# EAGLE schematic main (EAGLE 5.11)

## Sheet 1 of 9
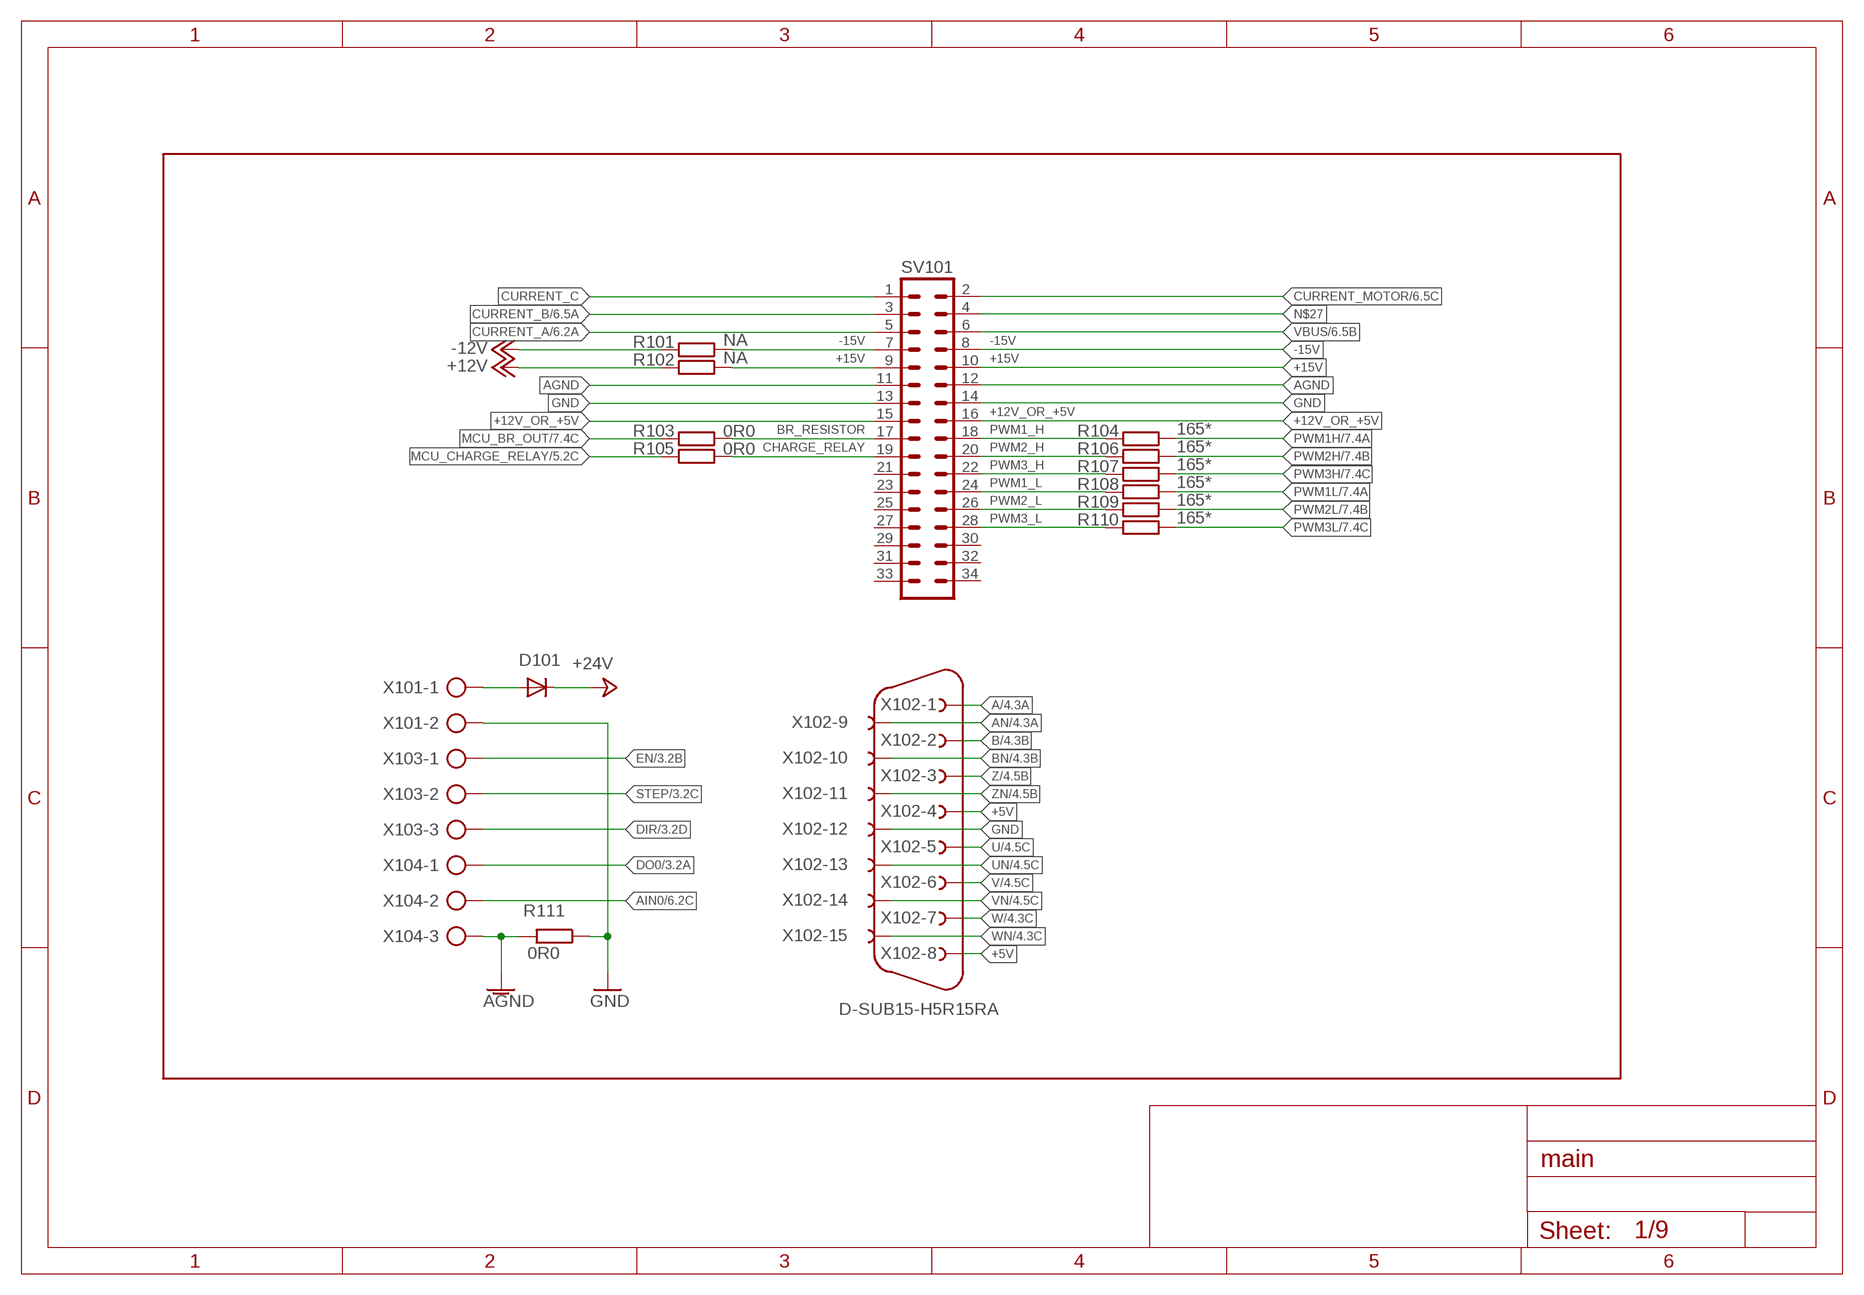
[diagram p0: schematic, sheet 1]

### Parts
D101  DIODE-SMB  [SMB]
R101  NA  R-EU_0204/2V  [0204V]
R102  NA  R-EU_0204/2V  [0204V]
R103  0R0  R-EU_0204/7  [0204/7]
R104  165*  R-EU_0204/2V  [0204V]
R105  0R0  R-EU_0204/7  [0204/7]
R106  165*  R-EU_0204/2V  [0204V]
R107  165*  R-EU_0204/2V  [0204V]
R108  165*  R-EU_0204/2V  [0204V]
R109  165*  R-EU_0204/2V  [0204V]
R110  165*  R-EU_0204/2V  [0204V]
R111  0R0  R-EU_0204/7  [0204/7]
SV101  ML34  [ML34]
X101  TS-502-2P  [TS-502-2P]
X102  D-SUB15-H5R15RA  [H5R15RA]
X103  TS-502-3P  [TS-502-3P]
X104  TS-502-3P  [TS-502-3P]

### Nets
+5V: X102.4 X102.8 ; also sheet 2,4
+12V: R102.2
+12V_OR_+5V: SV101.15 SV101.16
+15V: R102.1 SV101.9 SV101.10
+24V: D101.C ; also sheet 2,3
-12V: R101.2
-15V: R101.1 SV101.7 SV101.8
A: X102.1 ; also sheet 4
AGND: R111.2 SV101.11 SV101.12 X104.P$3 ; also sheet 6
AIN0: X104.P$2 ; also sheet 6
AN: X102.9 ; also sheet 4
B: X102.2 ; also sheet 4
BN: X102.10 ; also sheet 4
BR_RESISTOR: R103.1 SV101.17
CHARGE_RELAY: R105.1 SV101.19
CURRENT_A: SV101.5 ; also sheet 6
CURRENT_B: SV101.3 ; also sheet 6
CURRENT_C: SV101.1
CURRENT_MOTOR: SV101.2 ; also sheet 6
DIR: X103.P$3 ; also sheet 3
DO0: X104.P$1 ; also sheet 3
EN: X103.P$1 ; also sheet 3
GND: R111.1 SV101.13 SV101.14 X101.P$2 X102.12 ; also sheet 2,3,4,5,7,8,9
MCU_BR_OUT: R103.2 ; also sheet 7
MCU_CHARGE_RELAY: R105.2 ; also sheet 5
N$10: D101.A X101.P$1
N$27: SV101.4
PWM1_H: R104.2 SV101.18
PWM1_L: R108.2 SV101.24
PWM1H: R104.1 ; also sheet 7
PWM1L: R108.1 ; also sheet 7
PWM2_H: R106.2 SV101.20
PWM2_L: R109.2 SV101.26
PWM2H: R106.1 ; also sheet 7
PWM2L: R109.1 ; also sheet 7
PWM3_H: R107.2 SV101.22
PWM3_L: R110.2 SV101.28
PWM3H: R107.1 ; also sheet 7
PWM3L: R110.1 ; also sheet 7
STEP: X103.P$2 ; also sheet 3
U: X102.5 ; also sheet 4
UN: X102.13 ; also sheet 4
V: X102.6 ; also sheet 4
VBUS: SV101.6 ; also sheet 6
VN: X102.14 ; also sheet 4
W: X102.7 ; also sheet 4
WN: X102.15 ; also sheet 4
Z: X102.3 ; also sheet 4
ZN: X102.11 ; also sheet 4
Unconnected: SV101.21 SV101.23 SV101.25 SV101.27 SV101.29 SV101.30 SV101.31 SV101.32 SV101.33 SV101.34

## Sheet 2 of 9
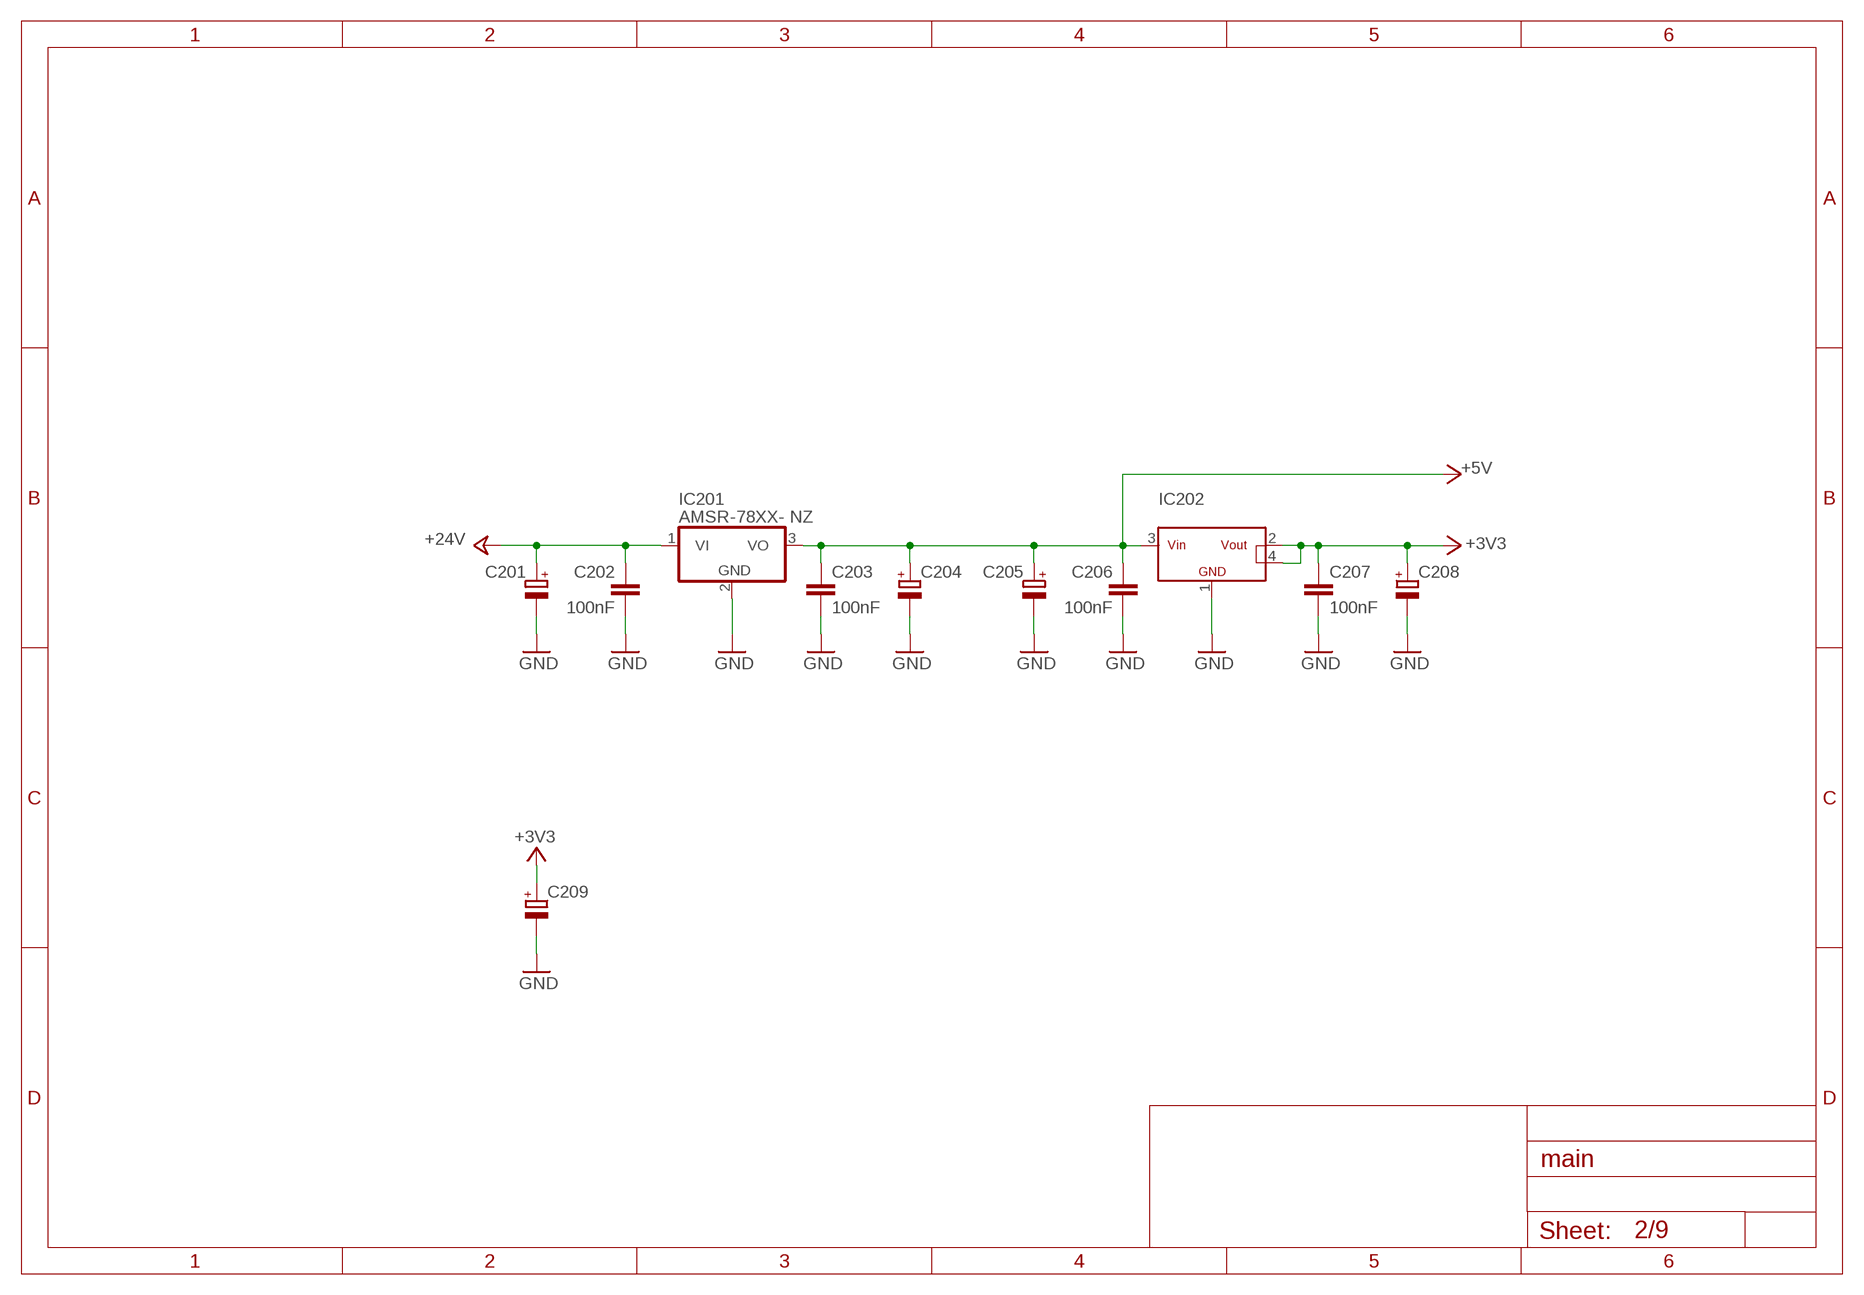
[diagram p1: schematic, sheet 2]

### Parts
C201  CPOL-EUE2.5-6  [E2,5-6]
C202  100nF  C-EUC1206  [C1206]
C203  100nF  C-EUC1206  [C1206]
C204  CPOL-EUE2.5-6  [E2,5-6]
C205  CPOL-EUE2.5-6  [E2,5-6]
C206  100nF  C-EUC1206  [C1206]
C207  100nF  C-EUC1206  [C1206]
C208  CPOL-EUE2.5-6  [E2,5-6]
C209  CPOL-EUE2.5-6  [E2,5-6]
IC201  AMSR-78XX- NZ  7805TV  [TO220V]
IC202  LM317_SOT223  [SOT223]

### Nets
+3V3: C207.1 C208.+ C209.+ IC202.2 IC202.4(TAB) ; also sheet 3,5,6,7,8,9
+5V: C203.1 C204.+ C205.+ C206.1 IC201.3(VO) IC202.3 ; also sheet 1,4
+24V: C201.+ C202.1 IC201.1(VI) ; also sheet 1,3
GND: C201.- C202.2 C203.2 C204.- C205.- C206.2 C207.2 C208.- C209.- IC201.2(GND) IC202.1 ; also sheet 1,3,4,5,7,8,9

## Sheet 3 of 9
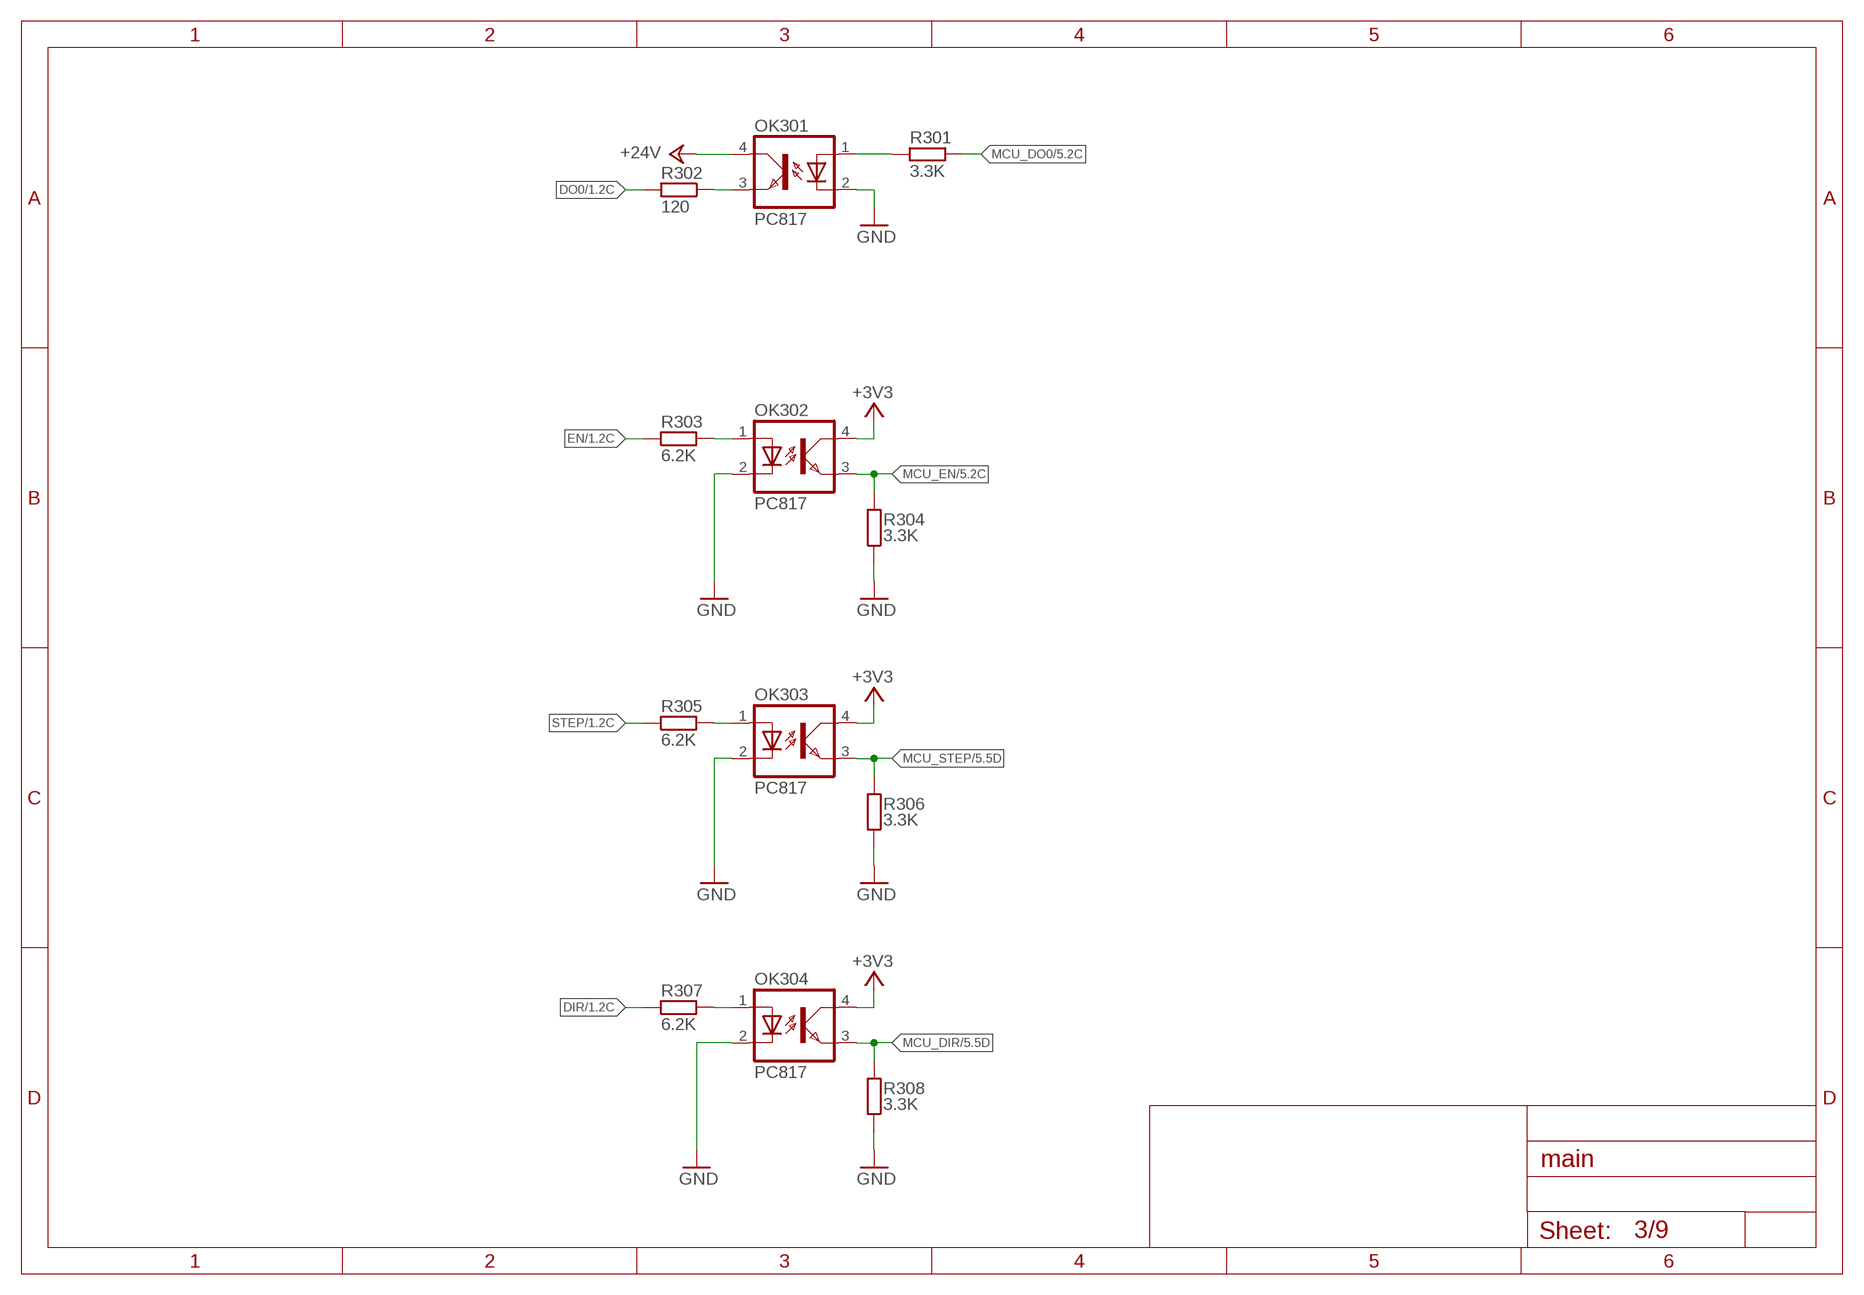
[diagram p2: schematic, sheet 3]

### Parts
OK301  PC817  [DIL04]
OK302  PC817  [DIL04]
OK303  PC817  [DIL04]
OK304  PC817  [DIL04]
R301  3.3K  R-EU_0204/2V  [0204V]
R302  120  R-EU_0204/2V  [0204V]
R303  6.2K  R-EU_0204/2V  [0204V]
R304  3.3K  R-EU_0204/2V  [0204V]
R305  6.2K  R-EU_0204/2V  [0204V]
R306  3.3K  R-EU_0204/2V  [0204V]
R307  6.2K  R-EU_0204/2V  [0204V]
R308  3.3K  R-EU_0204/2V  [0204V]

### Nets
+3V3: OK302.4(COL) OK303.4(COL) OK304.4(COL) ; also sheet 2,5,6,7,8,9
+24V: OK301.4(COL) ; also sheet 1,2
DIR: R307.1 ; also sheet 1
DO0: R302.2 ; also sheet 1
EN: R303.1 ; also sheet 1
GND: OK301.2(C) OK302.2(C) OK303.2(C) OK304.2(C) R304.1 R306.1 R308.1 ; also sheet 1,2,4,5,7,8,9
MCU_DIR: OK304.3(EMIT) R308.2 ; also sheet 5
MCU_DO0: R301.1 ; also sheet 5
MCU_EN: OK302.3(EMIT) R304.2 ; also sheet 5
MCU_STEP: OK303.3(EMIT) R306.2 ; also sheet 5
N$42: OK301.3(EMIT) R302.1
N$43: OK302.1(A) R303.2
N$44: OK303.1(A) R305.2
N$45: OK304.1(A) R307.2
N$47: OK301.1(A) R301.2
STEP: R305.1 ; also sheet 1

## Sheet 4 of 9
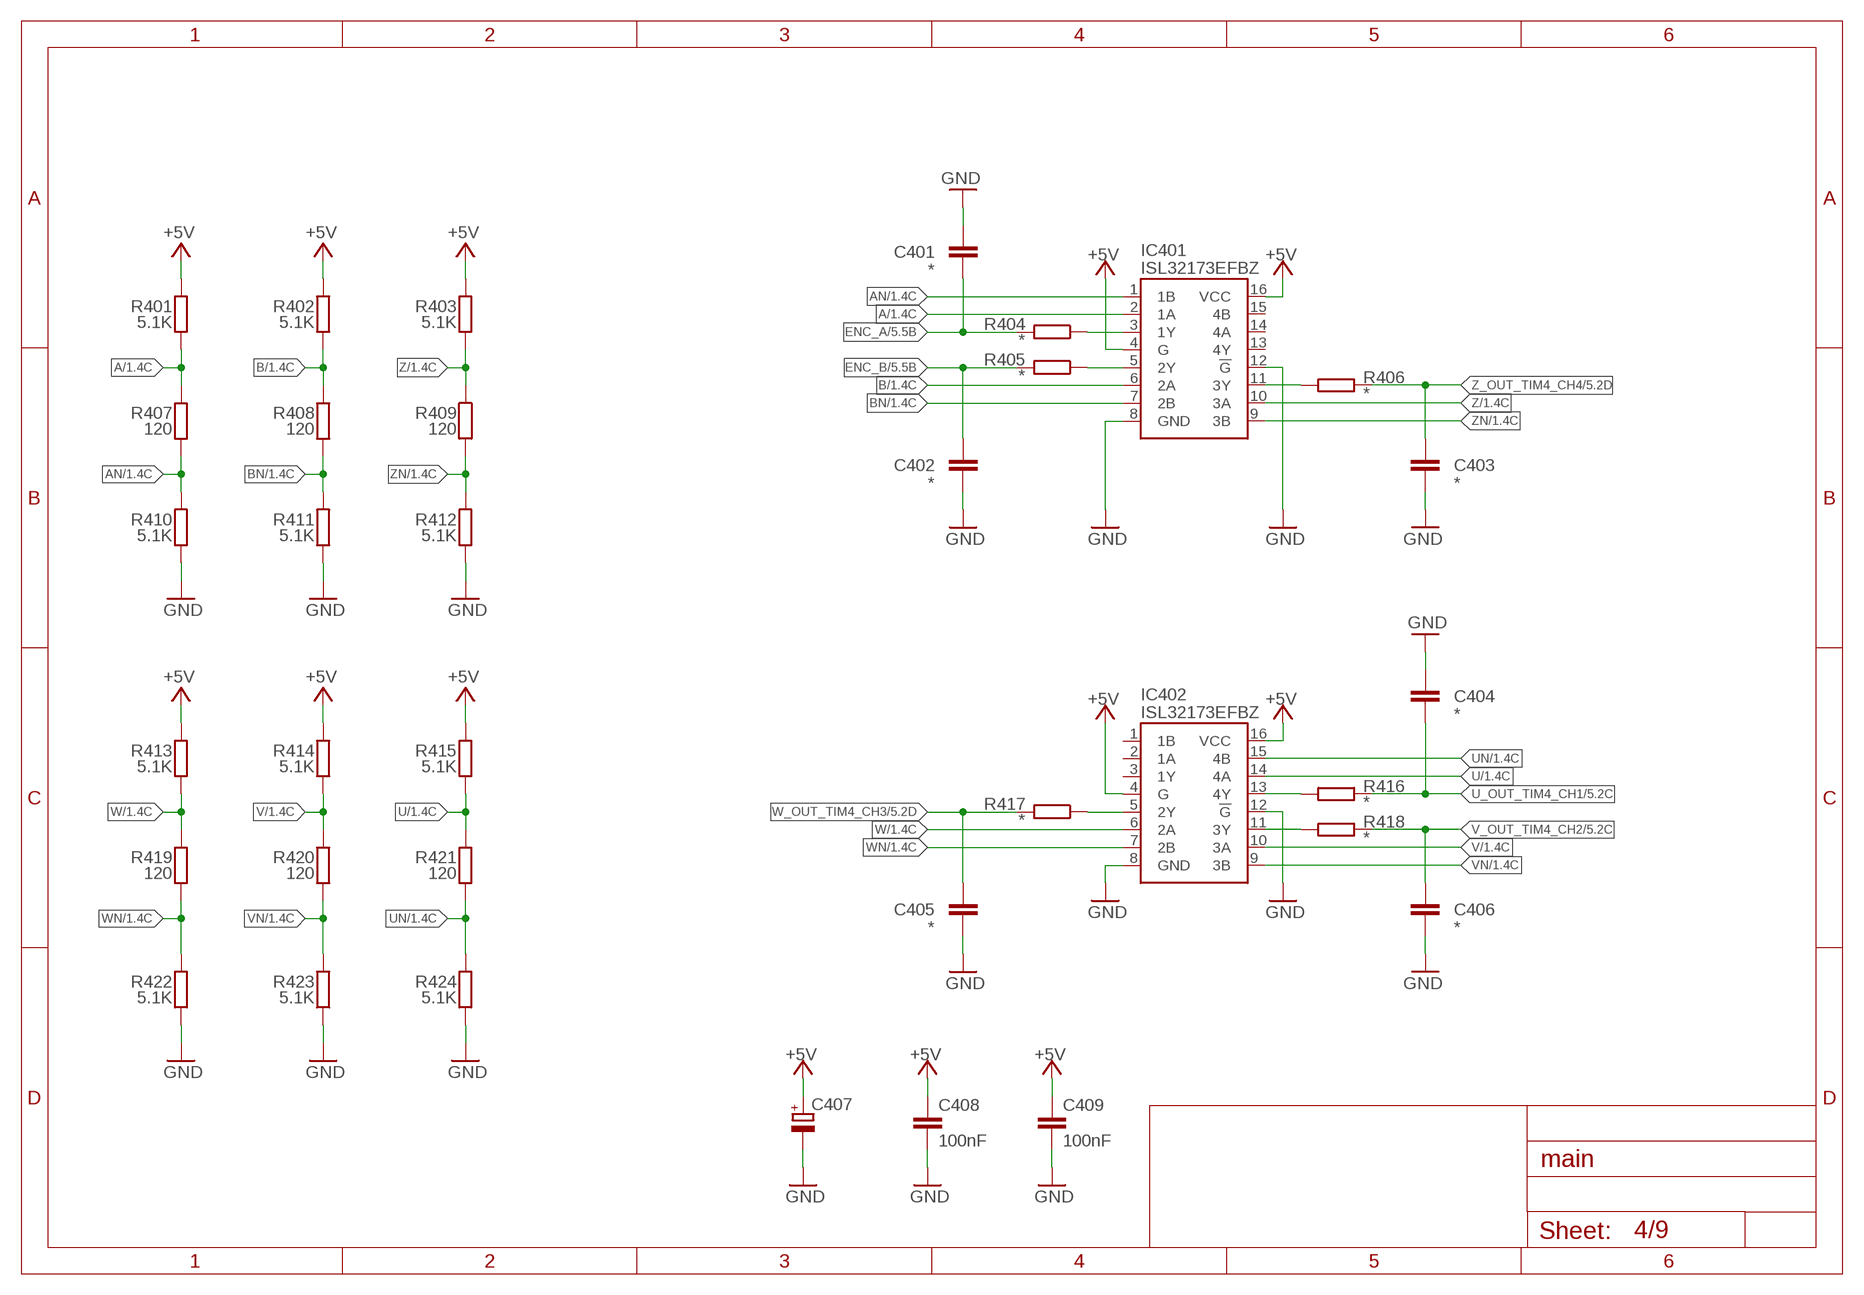
[diagram p3: schematic, sheet 4]

### Parts
C401  *  C-EUC0805  [C0805]
C402  *  C-EUC0805  [C0805]
C403  *  C-EUC0805  [C0805]
C404  *  C-EUC0805  [C0805]
C405  *  C-EUC0805  [C0805]
C406  *  C-EUC0805  [C0805]
C407  CPOL-EUE3.5-8  [E3,5-8]
C408  100nF  C-EUC0805  [C0805]
C409  100nF  C-EUC0805  [C0805]
IC401  ISL32173EFBZ  AM26LS32ACD  [SO16]
IC402  ISL32173EFBZ  AM26LS32ACD  [SO16]
R401  5.1K  R-EU_R0603  [R0603]
R402  5.1K  R-EU_R0603  [R0603]
R403  5.1K  R-EU_R0603  [R0603]
R404  *  R-EU_R1206  [R1206]
R405  *  R-EU_R1206  [R1206]
R406  *  R-EU_R1206  [R1206]
R407  120  R-EU_R1206  [R1206]
R408  120  R-EU_R1206  [R1206]
R409  120  R-EU_R1206  [R1206]
R410  5.1K  R-EU_R0603  [R0603]
R411  5.1K  R-EU_R0603  [R0603]
R412  5.1K  R-EU_R0603  [R0603]
R413  5.1K  R-EU_R0603  [R0603]
R414  5.1K  R-EU_R0603  [R0603]
R415  5.1K  R-EU_R0603  [R0603]
R416  *  R-EU_R1206  [R1206]
R417  *  R-EU_R1206  [R1206]
R418  *  R-EU_R1206  [R1206]
R419  120  R-EU_R1206  [R1206]
R420  120  R-EU_R1206  [R1206]
R421  120  R-EU_R1206  [R1206]
R422  5.1K  R-EU_R0603  [R0603]
R423  5.1K  R-EU_R0603  [R0603]
R424  5.1K  R-EU_R0603  [R0603]

### Nets
+5V: C407.+ C408.1 C409.1 IC401.4(G) IC401.16(VCC) IC402.4(G) IC402.16(VCC) R401.2 R402.2 R403.2 R413.2 R414.2 R415.2 ; also sheet 1,2
A: IC401.2(1A) R401.1 R407.1 ; also sheet 1
AN: IC401.1(1B) R407.2 R410.2 ; also sheet 1
B: IC401.6(2A) R402.1 R408.1 ; also sheet 1
BN: IC401.7(2B) R408.2 R411.2 ; also sheet 1
ENC_A: C401.2 R404.2 ; also sheet 5
ENC_B: C402.1 R405.2 ; also sheet 5
GND: C401.1 C402.2 C403.2 C404.1 C405.2 C406.2 C407.- C408.2 C409.2 IC401.8(GND) IC401.12(!G) IC402.8(GND) IC402.12(!G) R410.1 R411.1 R412.1 R422.1 R423.1 R424.1 ; also sheet 1,2,3,5,7,8,9
N$3: IC401.5(2Y) R405.1
N$60: IC401.3(1Y) R404.1
N$61: IC401.11(3Y) R406.2
N$62: IC402.11(3Y) R418.2
N$63: IC402.13(4Y) R416.2
N$64: IC402.5(2Y) R417.1
U: IC402.14(4A) R415.1 R421.1 ; also sheet 1
U_OUT_TIM4_CH1: C404.2 R416.1 ; also sheet 5
UN: IC402.15(4B) R421.2 R424.2 ; also sheet 1
V: IC402.10(3A) R414.1 R420.1 ; also sheet 1
V_OUT_TIM4_CH2: C406.1 R418.1 ; also sheet 5
VN: IC402.9(3B) R420.2 R423.2 ; also sheet 1
W: IC402.6(2A) R413.1 R419.1 ; also sheet 1
W_OUT_TIM4_CH3: C405.1 R417.2 ; also sheet 5
WN: IC402.7(2B) R419.2 R422.2 ; also sheet 1
Z: IC401.10(3A) R403.1 R409.1 ; also sheet 1
Z_OUT_TIM4_CH4: C403.1 R406.1 ; also sheet 5
ZN: IC401.9(3B) R409.2 R412.2 ; also sheet 1
Unconnected: IC401.13(4Y) IC401.14(4A) IC401.15(4B) IC402.1(1B) IC402.2(1A) IC402.3(1Y)

## Sheet 5 of 9
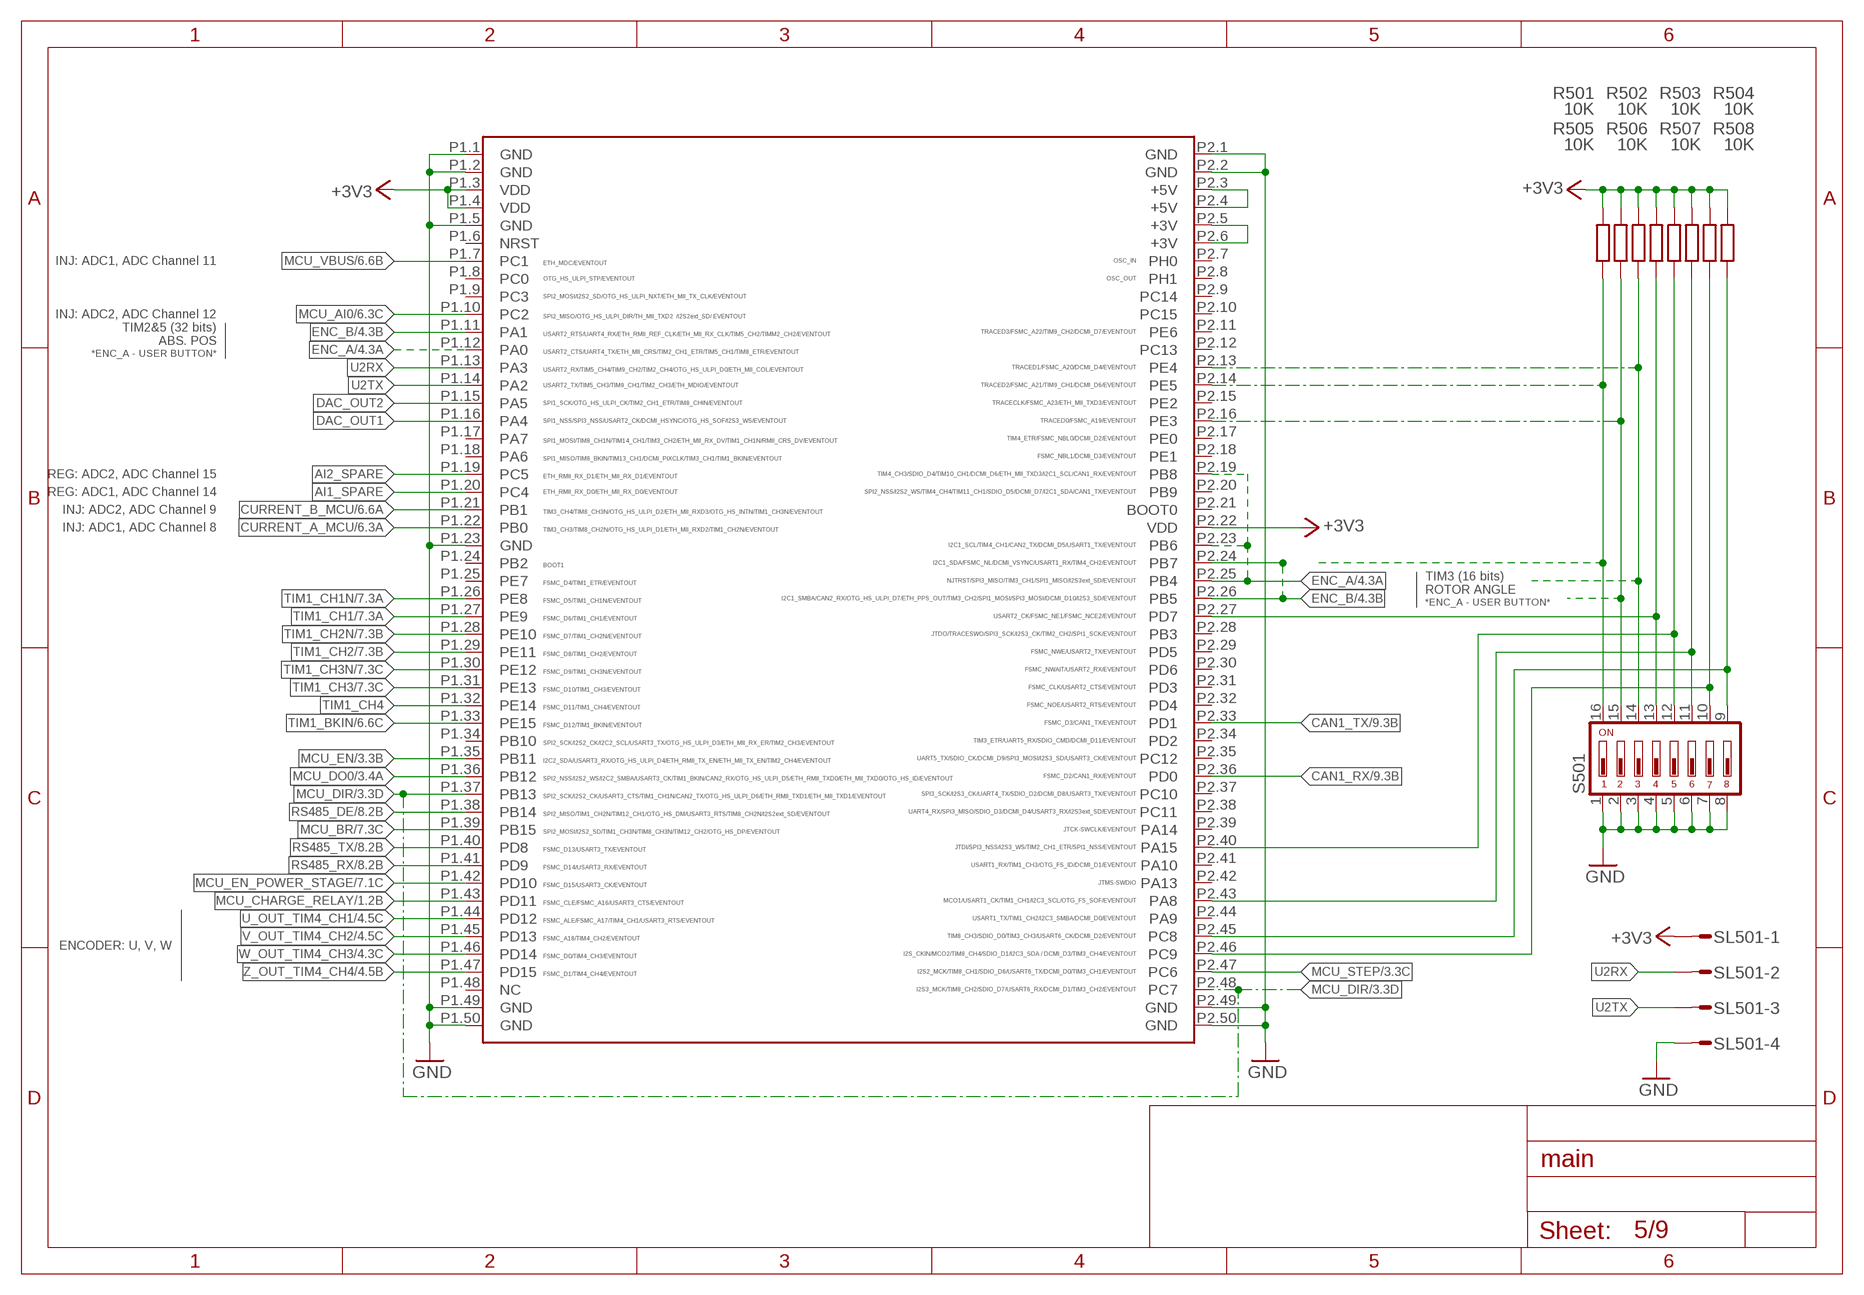
[diagram p4: schematic, sheet 5]

### Parts
IC501  STM32F4-DISCOVERYSTM32F4-DISCOVERY  [STM32F4-DISCOVERY]
R501  10K  R-EU_R0603  [R0603]
R502  10K  R-EU_R0603  [R0603]
R503  10K  R-EU_R0603  [R0603]
R504  10K  R-EU_R0603  [R0603]
R505  10K  R-EU_R0603  [R0603]
R506  10K  R-EU_R0603  [R0603]
R507  10K  R-EU_R0603  [R0603]
R508  10K  R-EU_R0603  [R0603]
S501  DS08  [DS-08]
SL501  M04S  [04P]

### Nets
+3V3: IC501.P1.3(VDD) IC501.P1.4(VDD) IC501.P2.22(VDD) R501.2 R502.2 R503.2 R504.2 R505.2 R506.2 R507.2 R508.2 SL501.1 ; also sheet 2,3,6,7,8,9
AI1_SPARE: IC501.P1.20(PC4)
AI2_SPARE: IC501.P1.19(PC5)
CAN1_RX: IC501.P2.36(PD0) ; also sheet 9
CAN1_TX: IC501.P2.33(PD1) ; also sheet 9
CURRENT_A_MCU: IC501.P1.22(PB0) ; also sheet 6
CURRENT_B_MCU: IC501.P1.21(PB1) ; also sheet 6
DAC_OUT1: IC501.P1.16(PA4)
DAC_OUT2: IC501.P1.15(PA5)
ENC_A: IC501.P1.12(PA0) IC501.P2.19(PB8) IC501.P2.23(PB6) IC501.P2.25(PB4) ; also sheet 4
ENC_B: IC501.P1.11(PA1) IC501.P2.24(PB7) IC501.P2.26(PB5) ; also sheet 4
GND: IC501.P1.1(GND) IC501.P1.2(GND) IC501.P1.5(GND) IC501.P1.23(GND) IC501.P1.49(GND) IC501.P1.50(GND) IC501.P2.1(GND) IC501.P2.2(GND) IC501.P2.49(GND) IC501.P2.50(GND) S501.1 S501.2 S501.3 S501.4 S501.5 S501.6 S501.7 S501.8 SL501.4 ; also sheet 1,2,3,4,7,8,9
MCU_AI0: IC501.P1.10(PC2) ; also sheet 6
MCU_BR: IC501.P1.39(PB15) ; also sheet 7
MCU_CHARGE_RELAY: IC501.P1.43(PD11) ; also sheet 1
MCU_DIR: IC501.P1.37(PB13) IC501.P2.48(PC7) ; also sheet 3
MCU_DO0: IC501.P1.36(PB12) ; also sheet 3
MCU_EN: IC501.P1.35(PB11) ; also sheet 3
MCU_EN_POWER_STAGE: IC501.P1.42(PD10) ; also sheet 7
MCU_STEP: IC501.P2.47(PC6) ; also sheet 3
MCU_VBUS: IC501.P1.7(PC1) ; also sheet 6
N$8: IC501.P2.5(+3V) IC501.P2.6(+3V)
N$9: IC501.P2.3(+5V) IC501.P2.4(+5V)
N$29: IC501.P2.45(PC8) R508.1 S501.9
N$30: IC501.P2.43(PA8) R506.1 S501.11
N$35: IC501.P2.14(PE5) R501.1 S501.16
N$72: IC501.P2.27(PD7) R504.1 S501.13
N$74: IC501.P2.16(PE3) R502.1 S501.15
N$75: IC501.P2.13(PE4) R503.1 S501.14
N$77: IC501.P2.46(PC9) R507.1 S501.10
N$78: IC501.P2.40(PA15) R505.1 S501.12
RS485_DE: IC501.P1.38(PB14) ; also sheet 8
RS485_RX: IC501.P1.41(PD9) ; also sheet 8
RS485_TX: IC501.P1.40(PD8) ; also sheet 8
TIM1_BKIN: IC501.P1.33(PE15) ; also sheet 6
TIM1_CH1: IC501.P1.27(PE9) ; also sheet 7
TIM1_CH1N: IC501.P1.26(PE8) ; also sheet 7
TIM1_CH2: IC501.P1.29(PE11) ; also sheet 7
TIM1_CH2N: IC501.P1.28(PE10) ; also sheet 7
TIM1_CH3: IC501.P1.31(PE13) ; also sheet 7
TIM1_CH3N: IC501.P1.30(PE12) ; also sheet 7
TIM1_CH4: IC501.P1.32(PE14)
U2RX: IC501.P1.13(PA3) SL501.2
U2TX: IC501.P1.14(PA2) SL501.3
U_OUT_TIM4_CH1: IC501.P1.44(PD12) ; also sheet 4
V_OUT_TIM4_CH2: IC501.P1.45(PD13) ; also sheet 4
W_OUT_TIM4_CH3: IC501.P1.46(PD14) ; also sheet 4
Z_OUT_TIM4_CH4: IC501.P1.47(PD15) ; also sheet 4
Unconnected: IC501.P1.6(NRST) IC501.P1.8(PC0) IC501.P1.9(PC3) IC501.P1.17(PA7) IC501.P1.18(PA6) IC501.P1.24(PB2) IC501.P1.25(PE7) IC501.P1.34(PB10) IC501.P1.48(NC) IC501.P2.7(PH0) IC501.P2.8(PH1) IC501.P2.9(PC14) IC501.P2.10(PC15) IC501.P2.11(PE6) IC501.P2.12(PC13) IC501.P2.15(PE2) IC501.P2.17(PE0) IC501.P2.18(PE1) IC501.P2.20(PB9) IC501.P2.21(BOOT0) IC501.P2.28(PB3) IC501.P2.29(PD5) IC501.P2.30(PD6) IC501.P2.31(PD3) IC501.P2.32(PD4) IC501.P2.34(PD2) IC501.P2.35(PC12) IC501.P2.37(PC10) IC501.P2.38(PC11) IC501.P2.39(PA14) IC501.P2.41(PA10) IC501.P2.42(PA13) IC501.P2.44(PA9)

### Notes on the sheet
- INJ: ADC1, ADC Channel 11
- INJ: ADC2, ADC Channel 12
- TIM2&5 (32 bits)
- ABS. POS
- *ENC_A - USER BUTTON*
- REG: ADC2, ADC Channel 15
- REG: ADC1, ADC Channel 14
- INJ: ADC2, ADC Channel 9
- INJ: ADC1, ADC Channel 8
- TIM3 (16 bits)
- ROTOR ANGLE
- *ENC_A - USER BUTTON*
- ENCODER: U, V, W

## Sheet 6 of 9
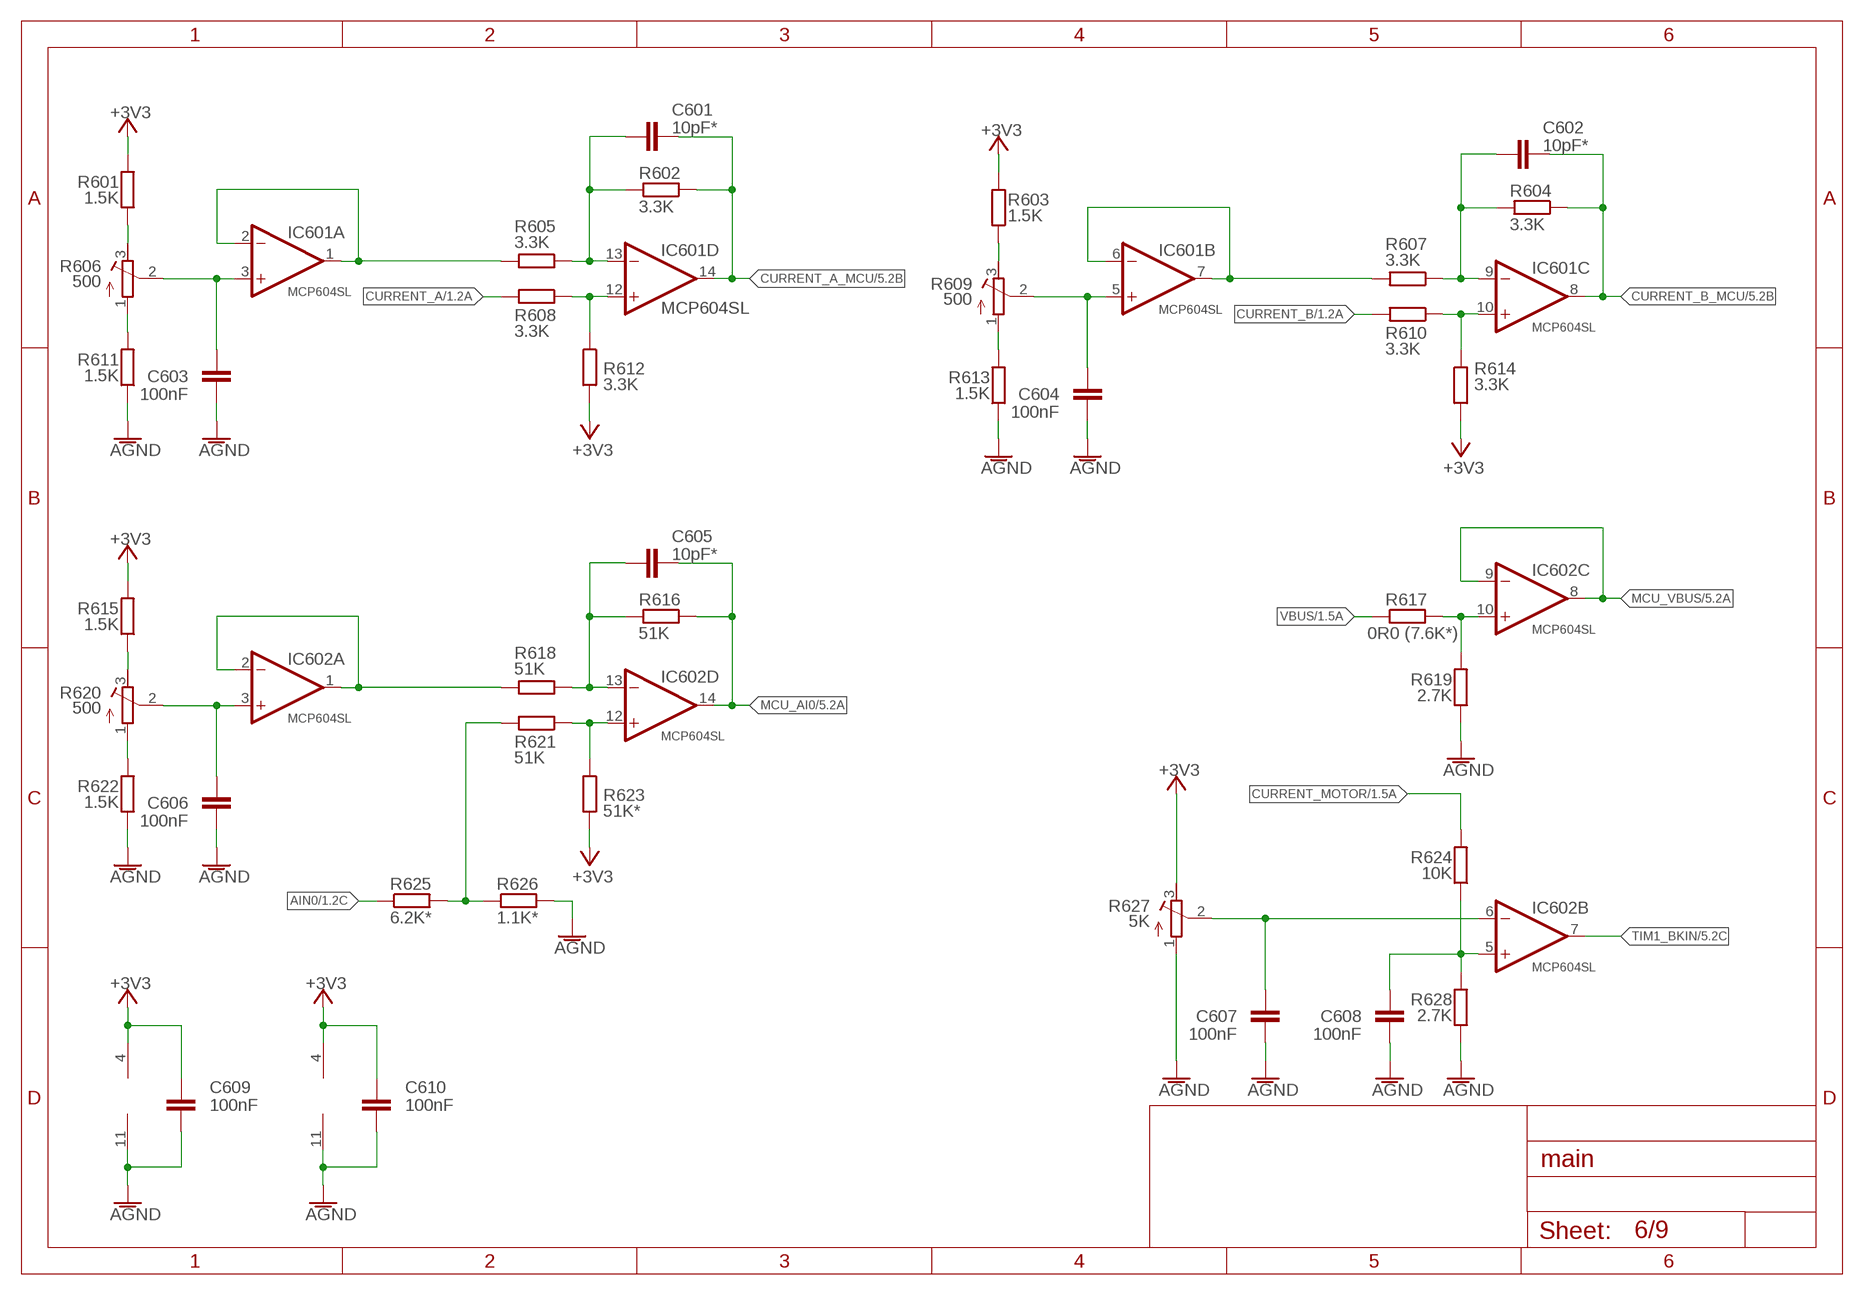
[diagram p5: schematic, sheet 6]

### Parts
C601  10pF*  C-EUC0603  [C0603]
C602  10pF*  C-EUC0603  [C0603]
C603  100nF  C-EUC0805  [C0805]
C604  100nF  C-EUC0805  [C0805]
C605  10pF*  C-EUC0603  [C0603]
C606  100nF  C-EUC0805  [C0805]
C607  100nF  C-EUC0805  [C0805]
C608  100nF  C-EUC0805  [C0805]
C609  100nF  C-EUC1206  [C1206]
C610  100nF  C-EUC1206  [C1206]
IC601  MCP604SL  [SO14]
IC602  MCP604SL  [SO14]
R601  1.5K  R-EU_0204/2V  [0204V]
R602  3.3K  R-EU_0204/2V  [0204V]
R603  1.5K  R-EU_0204/2V  [0204V]
R604  3.3K  R-EU_0204/2V  [0204V]
R605  3.3K  R-EU_0204/2V  [0204V]
R606  500  R-TRIMM3296W  [RTRIM3296W]
R607  3.3K  R-EU_0204/2V  [0204V]
R608  3.3K  R-EU_0204/2V  [0204V]
R609  500  R-TRIMM3296W  [RTRIM3296W]
R610  3.3K  R-EU_0204/2V  [0204V]
R611  1.5K  R-EU_0204/2V  [0204V]
R612  3.3K  R-EU_0204/2V  [0204V]
R613  1.5K  R-EU_0204/2V  [0204V]
R614  3.3K  R-EU_0204/2V  [0204V]
R615  1.5K  R-EU_0204/2V  [0204V]
R616  51K  R-EU_0204/2V  [0204V]
R617  0R0 (7.6K*)  R-EU_0204/2V  [0204V]
R618  51K  R-EU_0204/2V  [0204V]
R619  2.7K  R-EU_0204/2V  [0204V]
R620  500  R-TRIMM3296W  [RTRIM3296W]
R621  51K  R-EU_0204/2V  [0204V]
R622  1.5K  R-EU_0204/2V  [0204V]
R623  51K*  R-EU_0204/2V  [0204V]
R624  10K  R-EU_0204/2V  [0204V]
R625  6.2K*  R-EU_0204/2V  [0204V]
R626  1.1K*  R-EU_0204/2V  [0204V]
R627  5K  R-TRIMM3296W  [RTRIM3296W]
R628  2.7K  R-EU_0204/2V  [0204V]

### Nets
+3V3: C609.1 C610.1 IC601.4(P:V+) IC602.4(P:V+) R601.2 R603.2 R612.2 R614.2 R615.2 R623.2 R627.3(A) ; also sheet 2,3,5,7,8,9
AGND: C603.2 C604.2 C606.2 C607.2 C608.2 C609.2 C610.2 IC601.11(P:V-) IC602.11(P:V-) R611.1 R613.1 R619.1 R622.1 R626.2 R627.1(E) R628.1 ; also sheet 1
AIN0: R625.1 ; also sheet 1
CURRENT_A: R608.2 ; also sheet 1
CURRENT_A_MCU: C601.1 IC601.14(D:OUT) R602.1 ; also sheet 5
CURRENT_B: R610.2 ; also sheet 1
CURRENT_B_MCU: C602.1 IC601.8(C:OUT) R604.1 ; also sheet 5
CURRENT_MOTOR: R624.2 ; also sheet 1
MCU_AI0: C605.1 IC602.14(D:OUT) R616.1 ; also sheet 5
MCU_VBUS: IC602.8(C:OUT) IC602.9(C:-IN) ; also sheet 5
N$12: IC601.10(C:+IN) R610.1 R614.1
N$13: C602.2 IC601.9(C:-IN) R604.2 R607.1
N$16: IC601.6(B:-IN) IC601.7(B:OUT) R607.2
N$17: C604.1 IC601.5(B:+IN) R609.2(S)
N$18: R603.1 R609.3(A)
N$19: R609.1(E) R613.2
N$20: IC601.12(D:+IN) R608.1 R612.1
N$21: C601.2 IC601.13(D:-IN) R602.2 R605.1
N$22: R621.2 R625.2 R626.1
N$23: IC601.1(A:OUT) IC601.2(A:-IN) R605.2
N$24: C603.1 IC601.3(A:+IN) R606.2(S)
N$25: R601.1 R606.3(A)
N$26: R606.1(E) R611.2
N$54: IC602.12(D:+IN) R621.1 R623.1
N$55: C605.2 IC602.13(D:-IN) R616.2 R618.1
N$56: IC602.1(A:OUT) IC602.2(A:-IN) R618.2
N$57: C606.1 IC602.3(A:+IN) R620.2(S)
N$58: R615.1 R620.3(A)
N$59: R620.1(E) R622.2
N$66: IC602.10(C:+IN) R617.2 R619.2
N$67: C608.1 IC602.5(B:+IN) R624.1 R628.2
N$76: C607.1 IC602.6(B:-IN) R627.2(S)
TIM1_BKIN: IC602.7(B:OUT) ; also sheet 5
VBUS: R617.1 ; also sheet 1

## Sheet 7 of 9
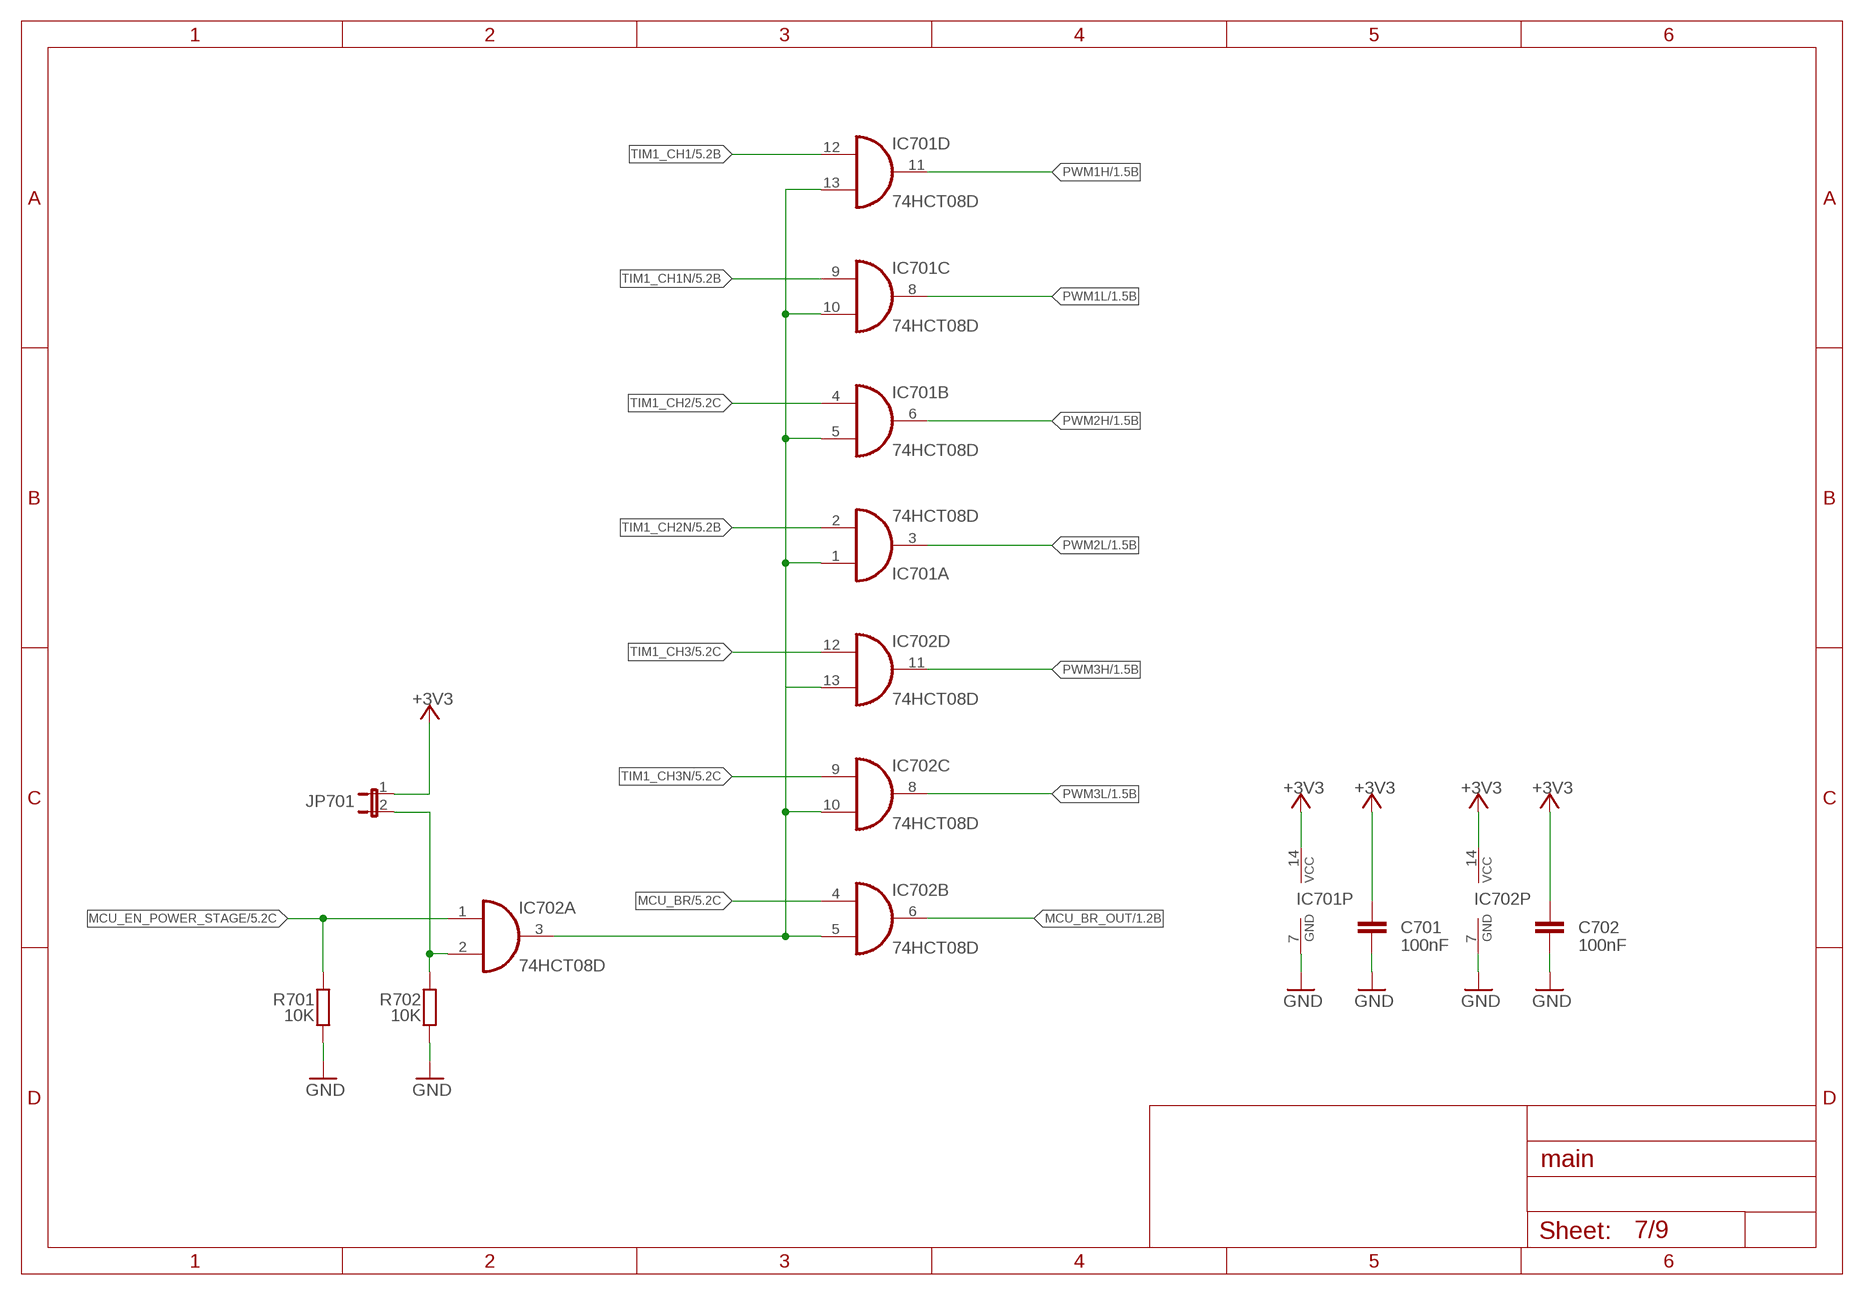
[diagram p6: schematic, sheet 7]

### Parts
C701  100nF  C-EUC0805  [C0805]
C702  100nF  C-EUC0805  [C0805]
IC701  74HCT08D  [SO14]
IC702  74HCT08D  [SO14]
JP701  JP1E  [JP1]
R701  10K  R-EU_R0603  [R0603]
R702  10K  R-EU_R0603  [R0603]

### Nets
+3V3: C701.1 C702.1 IC701.14(P:VCC) IC702.14(P:VCC) JP701.1 ; also sheet 2,3,5,6,8,9
GND: C701.2 C702.2 IC701.7(P:GND) IC702.7(P:GND) R701.1 R702.1 ; also sheet 1,2,3,4,5,8,9
MCU_BR: IC702.4(B:I0) ; also sheet 5
MCU_BR_OUT: IC702.6(B:O) ; also sheet 1
MCU_EN_POWER_STAGE: IC702.1(A:I0) R701.2 ; also sheet 5
N$5: IC702.2(A:I1) JP701.2 R702.2
N$14: IC701.1(A:I0) IC701.5(B:I1) IC701.10(C:I1) IC701.13(D:I1) IC702.3(A:O) IC702.5(B:I1) IC702.10(C:I1) IC702.13(D:I1)
PWM1H: IC701.11(D:O) ; also sheet 1
PWM1L: IC701.8(C:O) ; also sheet 1
PWM2H: IC701.6(B:O) ; also sheet 1
PWM2L: IC701.3(A:O) ; also sheet 1
PWM3H: IC702.11(D:O) ; also sheet 1
PWM3L: IC702.8(C:O) ; also sheet 1
TIM1_CH1: IC701.12(D:I0) ; also sheet 5
TIM1_CH1N: IC701.9(C:I0) ; also sheet 5
TIM1_CH2: IC701.4(B:I0) ; also sheet 5
TIM1_CH2N: IC701.2(A:I1) ; also sheet 5
TIM1_CH3: IC702.12(D:I0) ; also sheet 5
TIM1_CH3N: IC702.9(C:I0) ; also sheet 5

## Sheet 8 of 9
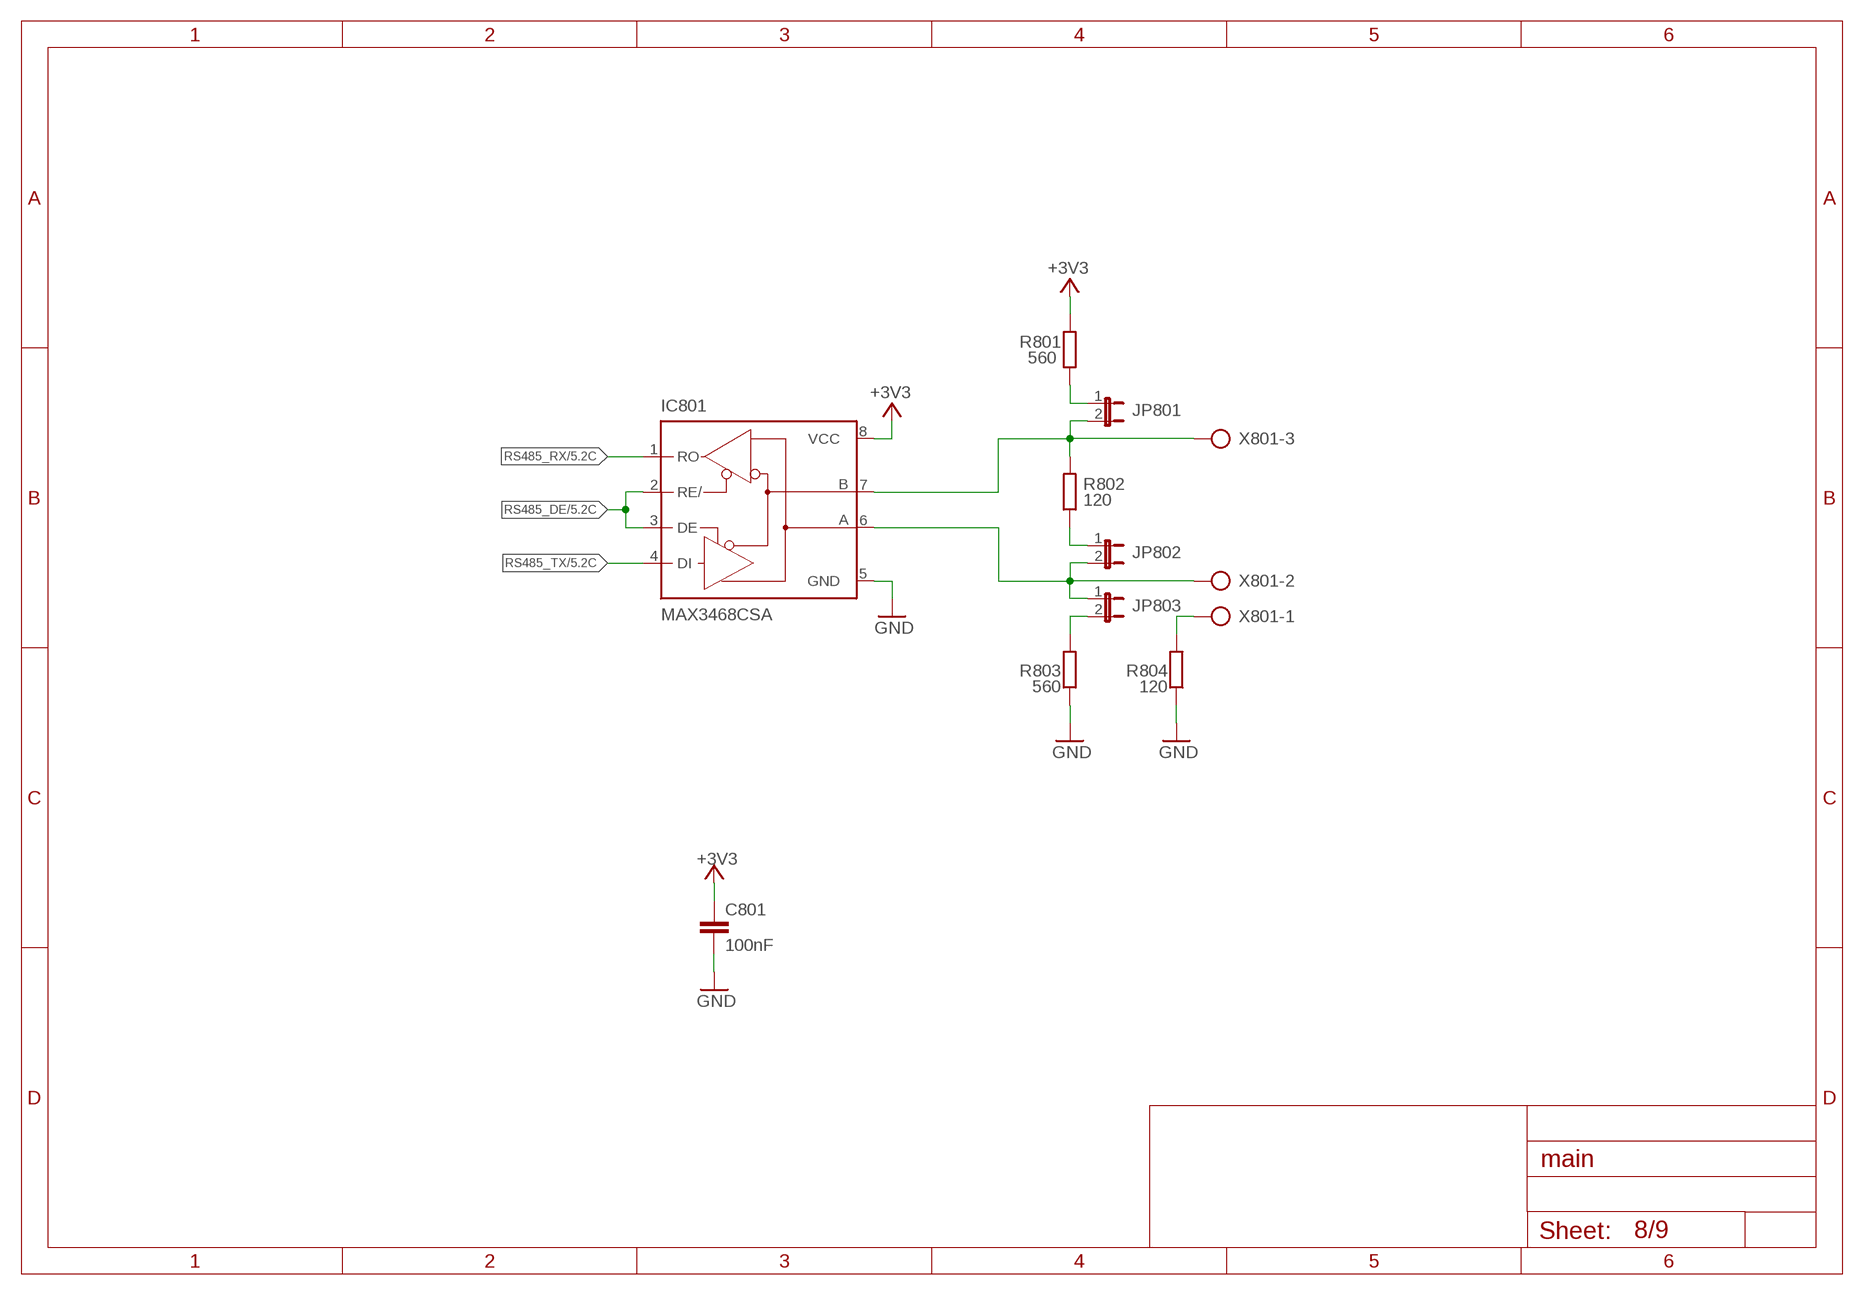
[diagram p7: schematic, sheet 8]

### Parts
C801  100nF  C-EUC0603  [C0603]
IC801  MAX3468CSA  [SO08]
JP801  JP1E  [JP1]
JP802  JP1E  [JP1]
JP803  JP1E  [JP1]
R801  560  R-EU_R1206  [R1206]
R802  120  R-EU_R1206  [R1206]
R803  560  R-EU_R1206  [R1206]
R804  120  R-EU_R1206  [R1206]
X801  TS-502-3P  [TS-502-3P]

### Nets
+3V3: C801.1 IC801.8(VCC) R801.2 ; also sheet 2,3,5,6,7,9
GND: C801.2 IC801.5(GND) R803.1 R804.1 ; also sheet 1,2,3,4,5,7,9
N$11: IC801.7(B) JP801.2 R802.2 X801.P$3
N$31: JP803.2 R803.2
N$32: JP802.1 R802.1
N$33: IC801.6(A) JP802.2 JP803.1 X801.P$2
N$37: R804.2 X801.P$1
N$38: JP801.1 R801.1
RS485_DE: IC801.2(RE/) IC801.3(DE) ; also sheet 5
RS485_RX: IC801.1(RO) ; also sheet 5
RS485_TX: IC801.4(DI) ; also sheet 5

## Sheet 9 of 9
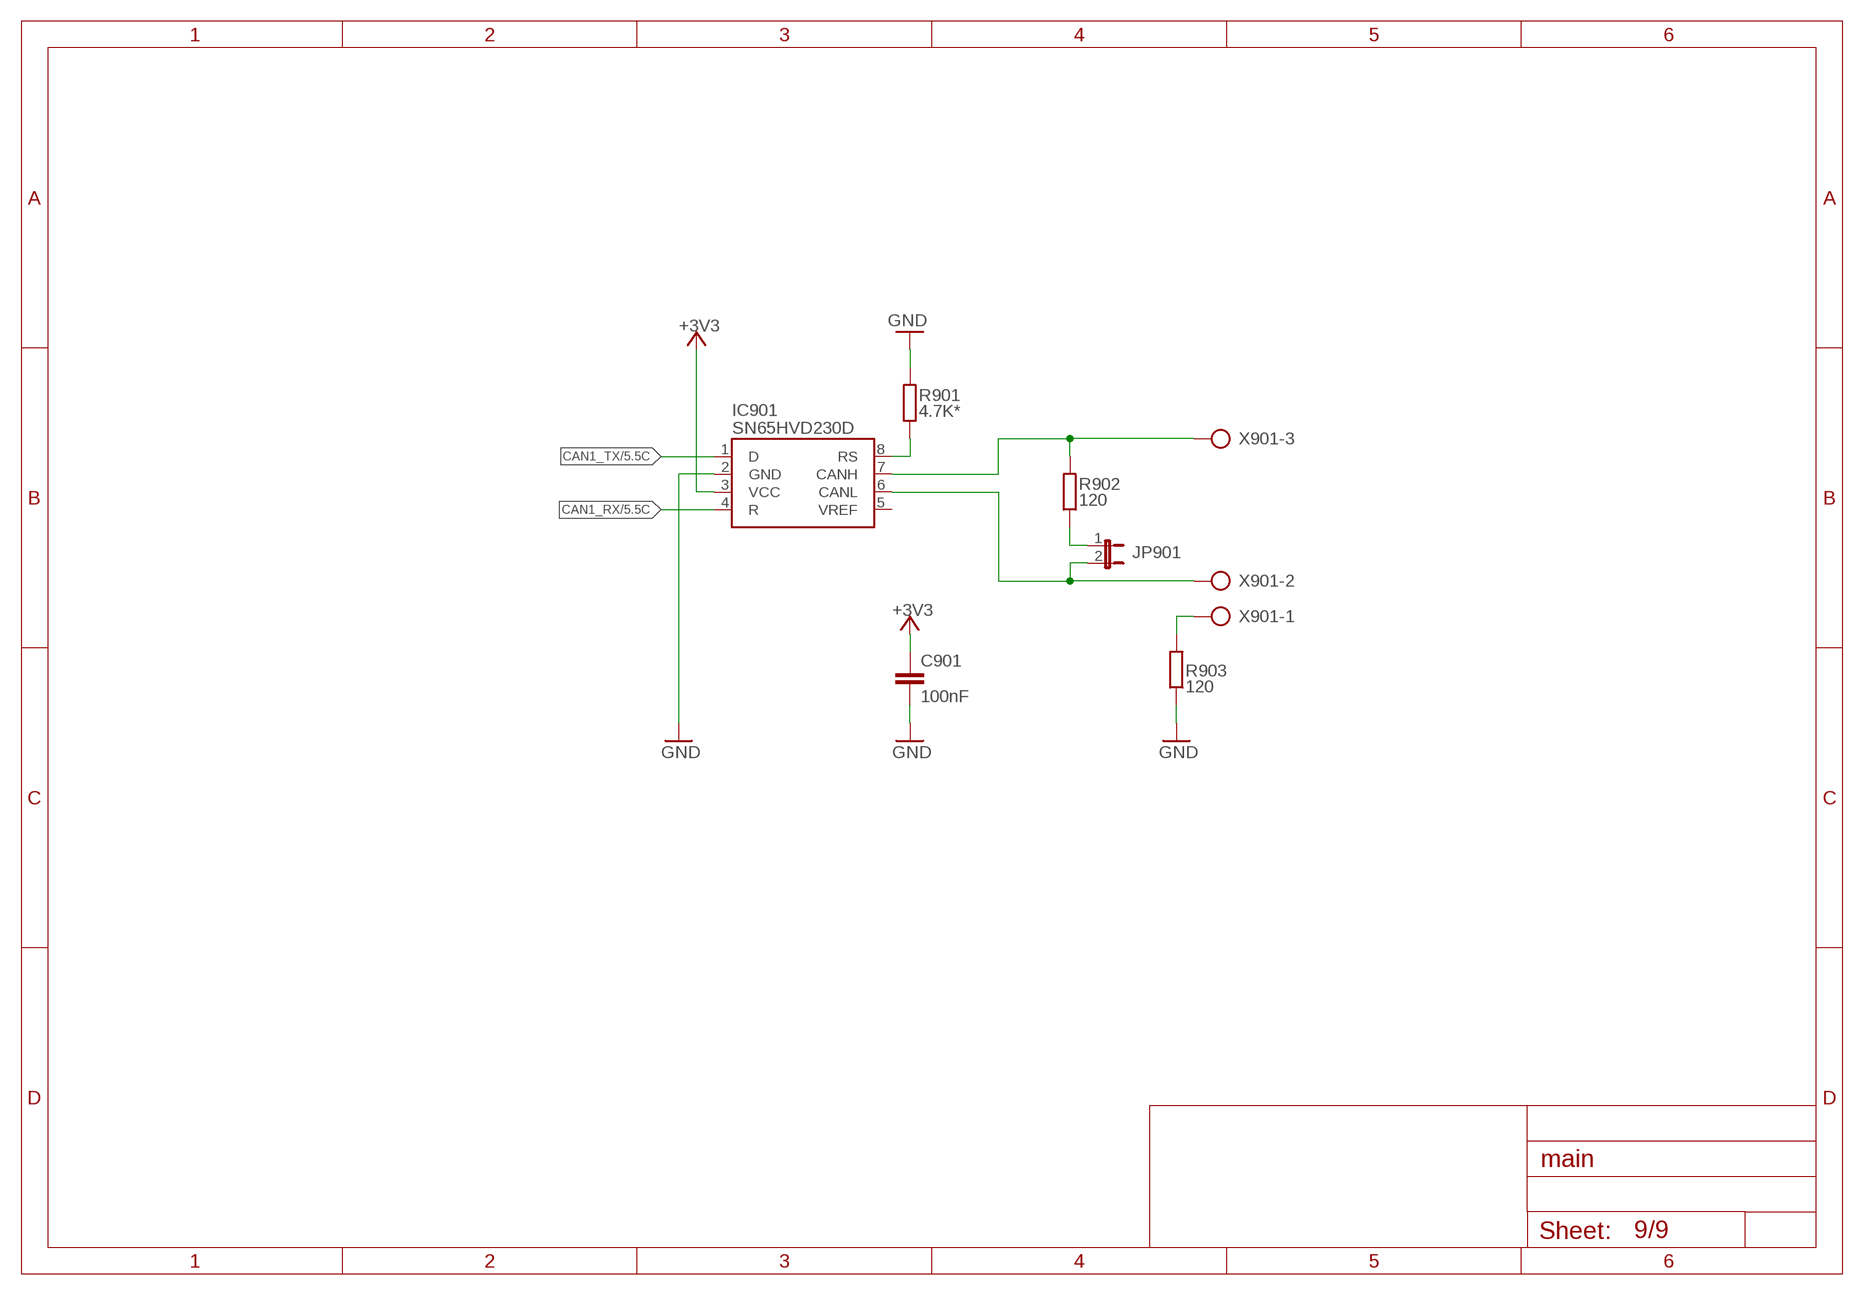
[diagram p8: schematic, sheet 9]

### Parts
C901  100nF  C-EUC0603  [C0603]
IC901  SN65HVD230D  [SO08]
JP901  JP1E  [JP1]
R901  4.7K*  R-EU_0204/2V  [0204V]
R902  120  R-EU_R1206  [R1206]
R903  120  R-EU_R1206  [R1206]
X901  TS-502-3P  [TS-502-3P]

### Nets
+3V3: C901.1 IC901.3(VCC) ; also sheet 2,3,5,6,7,8
CAN1_RX: IC901.4(R) ; also sheet 5
CAN1_TX: IC901.1(D) ; also sheet 5
GND: C901.2 IC901.2(GND) R901.2 R903.1 ; also sheet 1,2,3,4,5,7,8
N$4: IC901.8(RS) R901.1
N$68: IC901.7(CANH) R902.2 X901.P$3
N$69: JP901.1 R902.1
N$70: IC901.6(CANL) JP901.2 X901.P$2
N$71: R903.2 X901.P$1
Unconnected: IC901.5(VREF)

## Library data of the parts
C201 C204 C205 C208 C209 C407 = rcl:CPOL-EU: POLARIZED CAPACITOR, European symbol
C202 C203 C206 C207 C401-C406 C408 C409 C601-C610 C701 C702 C801 C901 = rcl:C-EU: CAPACITOR, European symbol
D101 = diode:DIODE-: DIODE
IC201 = linear:78*: Positive VOLTAGE REGULATOR Source: http://cache.national.com/ds/LM/LM78L05.pdf http://www.fairchildsemi.com/ds/LM/LM7805.pdf
IC202 = linear:LM317_SOT223
IC401 IC402 = myIC:AM26LS32A*
IC501 = STM32F4-DISCOVERY:STM32F4-DISCOVERY
IC601 IC602 = linear:MCP604: Quad Op Amp 2.7V to 6.0V Single Supply CMOS Source: http://ww1.microchip.com/downloads/en/DeviceDoc/21314g.pdf
IC701 IC702 = 74xx-eu:74*08: Quad 2-input AND gate
IC801 = maxim:MAX34*: +5V, Fail-Safe, 40Mbps, Profibus RS-485/RS-422 Transceivers Source: MAX3465-MAX3469.pdf; MPN: MAX3468CSA+; OC_FARNELL: unknown; OC_NEWARK: 76K6721
IC901 = myTI:SN65HVD230D
JP701 JP801-JP803 JP901 = jumper:JP1E: JUMPER
OK301-OK304 = optocoupler:PC817: SHARP OPTO COUPLER; MPN: PC817X4J000F; OC_FARNELL: 9707727; OC_NEWARK: 97K7059
R101-R111 R301-R308 R401-R424 R501-R508 R601-R605 R607 R608 R610-R619 R621-R626 R628 R701 R702 R801-R804 R901-R903 = rcl:R-EU_: RESISTOR, European symbol
R606 R609 R620 R627 = rcl:R-TRIMM: Trimm resistor
S501 = switch-dil:DS08: DIL/CODE SWITCH; MPN: DS08; OC_FARNELL: unknown; OC_NEWARK: 73J0071
SL501 = con-amp-quick:M04S: AMP QUICK CONNECTOR; OC_FARNELL: unknown; OC_NEWARK: unknown
SV101 = con-harting-ml:ML34: HARTING; OC_FARNELL: unknown; OC_NEWARK: unknown
X101 = myCon-HowDer:TS-502-2P
X102 = con-thomas-betts:D-SUB15-: D-Subminiatur Connector Source: Electronioc Interconnects European Edition 1998; MF: TYCO ELECTRONICS; MPN: H5R15RA29B; OC_FARNELL: unknown; OC_NEWARK: 93F8335
X103 X104 X801 X901 = myCon-HowDer:TS-502-3P